# Altium schematic sheet jfino-anchor.SchDoc: jfino-anchor
size A3; ApprovedBy: batt; Author: djeasy; Revision: 1.0 2017; SheetNumber: 1; SheetTotal: 1
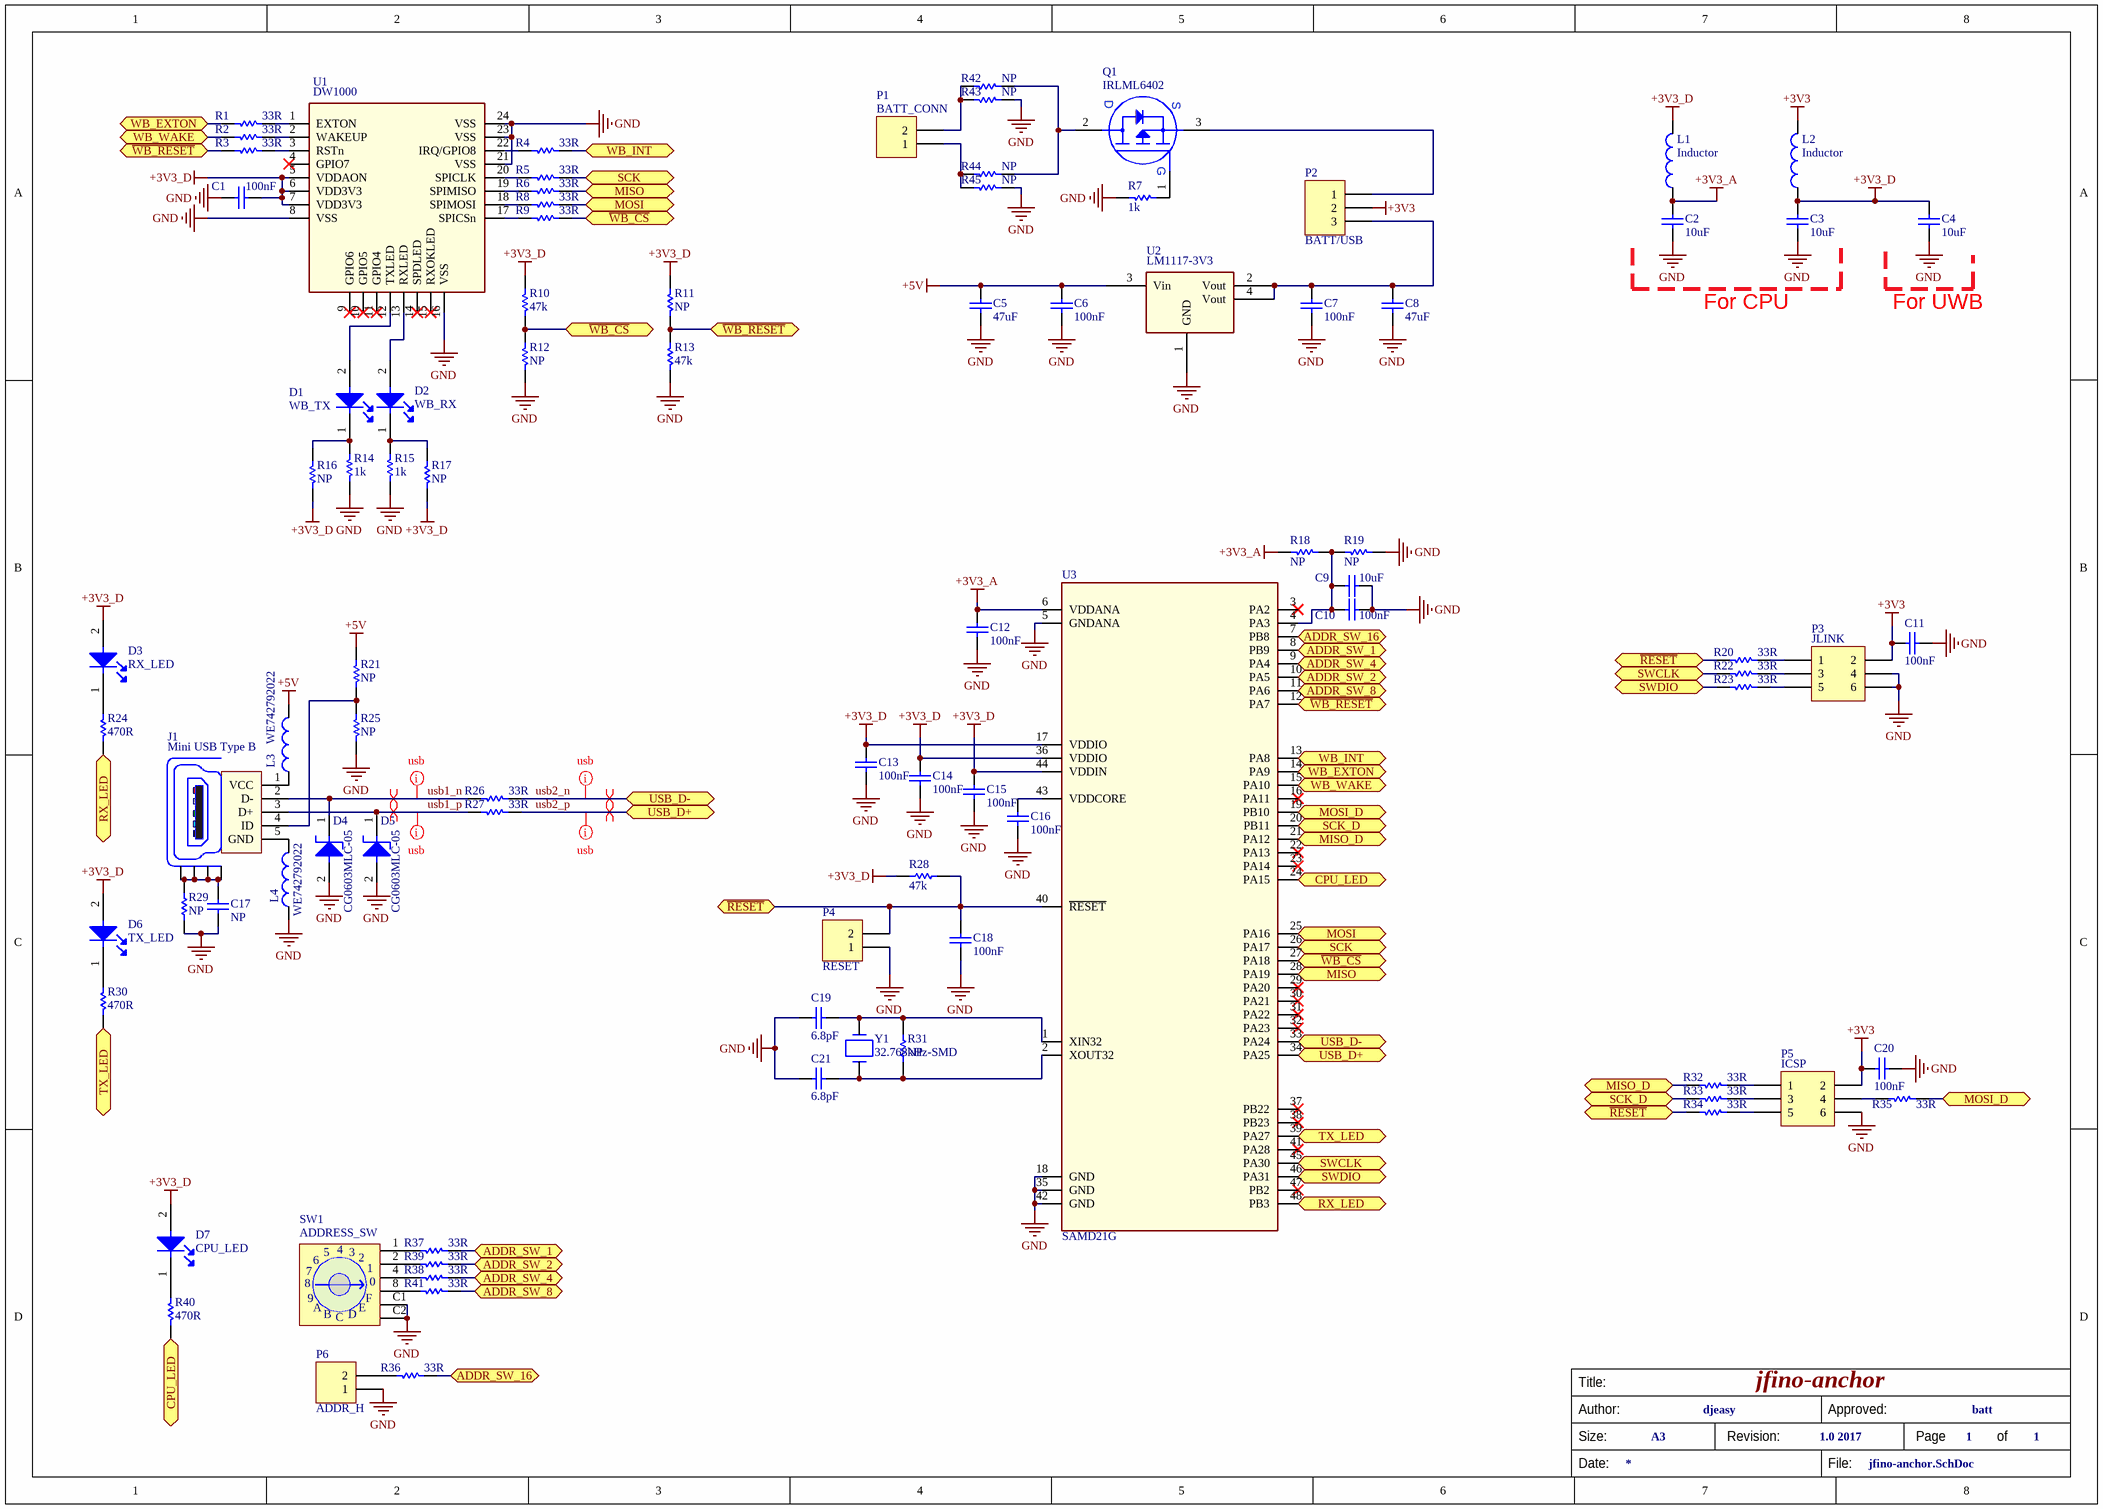
[diagram p0: jfino-anchor.SchDoc]

## Parts
C1  100nF  [0603_[1608]]
C2  10uF  [1206_[3216]]
C3  10uF  [1206_[3216]]
C4  10uF  [1206_[3216]]
C5  47uF  [1206_[3216]]
C6  100nF  [0603_[1608]]
C7  100nF  [0603_[1608]]
C8  47uF  [1206_[3216]]
C9  10uF  [1206_[3216]]
C10  100nF  [0603_[1608]]
C11  100nF  [0603_[1608]]
C12  100nF  [0603_[1608]]
C13  100nF  [0603_[1608]]
C14  100nF  [0603_[1608]]
C15  100nF  [0603_[1608]]
C16  100nF  [0603_[1608]]
C17  NP  [1808_[4520]]
C18  100nF  [0603_[1608]]
C19  6.8pF  [0603_[1608]]
C20  100nF  [0603_[1608]]
C21  6.8pF  [0603_[1608]]
D1  WB_TX  [0603_[1608]_K1-A2_LED]
D2  WB_RX  [0603_[1608]_K1-A2_LED]
D3  RX_LED  [0603_[1608]_K1-A2_LED]
D4  CG0603MLC-05  [0603_[1608]]
D5  CG0603MLC-05  [0603_[1608]]
D6  TX_LED  [0603_[1608]_K1-A2_LED]
D7  CPU_LED  [0603_[1608]_K1-A2_LED]
J1  Mini USB Type B  [USB_MICRO_B_SMD]
L1  Inductor  [0805_[2012]]
L2  Inductor  [0805_[2012]]
L3  WE742792022  [0805_[2012]]
L4  WE742792022  [0805_[2012]]
P1  BATT_CONN  [BATTERY_CONNECTOR_LIPO_THD]
P2  BATT/USB  [HEADER_1X3_2.54MM_THD]
P3  JLINK  [HEADER_2X3_2.54MM_THD]
P4  RESET  [HEADER_1X2_2.54MM_THD]
P5  ICSP  [HEADER_2X3_2.54MM_THD]
P6  ADDR_H  [HEADER_1X2_2.54MM_THD]
Q1  IRLML6402  [SOT-23]
R1  33R  [0603_[1608]]
R2  33R  [0603_[1608]]
R3  33R  [0603_[1608]]
R4  33R  [0603_[1608]]
R5  33R  [0603_[1608]]
R6  33R  [0603_[1608]]
R7  1k  [0603_[1608]]
R8  33R  [0603_[1608]]
R9  33R  [0603_[1608]]
R10  47k  [0603_[1608]]
R11  NP  [0603_[1608]]
R12  NP  [0603_[1608]]
R13  47k  [0603_[1608]]
R14  1k  [0603_[1608]]
R15  1k  [0603_[1608]]
R16  NP  [0603_[1608]]
R17  NP  [0603_[1608]]
R18  NP  [0603_[1608]]
R19  NP  [0603_[1608]]
R20  33R  [0603_[1608]]
R21  NP  [0603_[1608]]
R22  33R  [0603_[1608]]
R23  33R  [0603_[1608]]
R24  470R  [0603_[1608]]
R25  NP  [0603_[1608]]
R26  33R  [0603_[1608]]
R27  33R  [0603_[1608]]
R28  47k  [0603_[1608]]
R29  NP  [0805_[2012]]
R30  470R  [0603_[1608]]
R31  NP  [0603_[1608]]
R32  33R  [0603_[1608]]
R33  33R  [0603_[1608]]
R34  33R  [0603_[1608]]
R35  33R  [0603_[1608]]
R36  33R  [0603_[1608]]
R37  33R  [0603_[1608]]
R38  33R  [0603_[1608]]
R39  33R  [0603_[1608]]
R40  470R  [0603_[1608]]
R41  33R  [0603_[1608]]
R42  NP  [0603_[1608]]
R43  NP  [0603_[1608]]
R44  NP  [0603_[1608]]
R45  NP  [0603_[1608]]
SW1  ADDRESS_SW  [rotary_switch]
U1  DW1000  [DWM1000]
U2  LM1117-3V3  [SOT-223]
U3  SAMD21G  [LQFP-48_7x7MM_0.5MM]
Y1  32.768kHz-SMD  [CRYSTAL_4X1.5MM_2P_SMD]

## Ports
ADDR_SW_1 (bidir), ADDR_SW_2 (bidir), ADDR_SW_4 (bidir), ADDR_SW_8 (bidir), ADDR_SW_16 (bidir), CPU_LED (bidir), MISO (bidir), MISO_D (bidir), MOSI (bidir), MOSI_D (bidir), RX_LED (bidir), SCK (bidir), SCK_D (bidir), SWCLK (bidir), SWDIO (bidir), TX_LED (bidir), USB_D+ (bidir), USB_D- (bidir), WB_EXTON (bidir), WB_INT (bidir), WB_WAKE (bidir), ~{RESET} (bidir), ~{WB_CS} (bidir), ~{WB_RESET} (bidir)

## Nets
+3V3: C11.1 C20.1 L2.2 P2.2 P3.2 P5.2
+3V3_A: C2.2 C12.2 L1.1 R18.2 U3.6(VDDANA)
+3V3_D: C1.2 C3.2 C4.2 C13.2 C14.2 C15.2 D3.2(A) D6.2(A) D7.2(A) L1.2 L2.1 R10.2 R11.2 R16.1 R17.1 R28.2 U1.5(VDDAON) U1.6(VDD3V3) U1.7(VDD3V3) U3.17(VDDIO) U3.36(VDDIO) U3.44(VDDIN)
+5V: C5.2 C6.2 L3.2 R21.2 U2.3(Vin)
GND: C1.1 C2.1 C3.1 C4.1 C5.1 C6.1 C7.1 C8.1 C9.1 C10.1 C11.2 C12.1 C13.1 C14.1 C15.1 C16.1 C17.1 C18.1 C19.2 C20.2 C21.2 D4.2 D5.2 L4.1 P3.4 P3.6 P4.1 P5.6 P6.1 R7.2 R12.2 R13.2 R14.1 R15.1 R19.1 R25.1 R29.2 R43.2 R45.2 SW1.C1 SW1.C2 U1.8(VSS) U1.16(VSS) U1.21(VSS) U1.23(VSS) U1.24(VSS) U2.1(GND) U3.5(GNDANA) U3.18(GND) U3.35(GND) U3.42(GND)
~{RESET}: C18.2 P4.2 R20.1 R28.1 R34.1 U3.40(~{RESET}) ; port ~{RESET}
~{WB_CS}: R9.2 R10.1 R12.1 U3.27(PA18) ; port ~{WB_CS}
~{WB_RESET}: R3.1 R11.1 R13.1 U3.12(PA7) ; port ~{WB_RESET}
ADDR_SW_1: R37.2 U3.8(PB9) ; port ADDR_SW_1
ADDR_SW_2: R39.2 U3.10(PA5) ; port ADDR_SW_2
ADDR_SW_4: R38.2 U3.9(PA4) ; port ADDR_SW_4
ADDR_SW_8: R41.2 U3.11(PA6) ; port ADDR_SW_8
ADDR_SW_16: R36.2 U3.7(PB8) ; port ADDR_SW_16
CPU_LED: R40.1 U3.24(PA15) ; port CPU_LED
MISO: R6.2 U3.28(PA19) ; port MISO
MISO_D: R32.1 U3.21(PA12) ; port MISO_D
MOSI: R8.2 U3.25(PA16) ; port MOSI
MOSI_D: R35.2 U3.19(PB10) ; port MOSI_D
RX_LED: R24.1 U3.48(PB3) ; port RX_LED
SCK: R5.2 U3.26(PA17) ; port SCK
SCK_D: R33.1 U3.20(PB11) ; port SCK_D
SWCLK: R22.1 U3.45(PA30) ; port SWCLK
SWDIO: R23.1 U3.46(PA31) ; port SWDIO
TX_LED: R30.1 U3.39(PA27) ; port TX_LED
usb1_n: D4.1 J1.2(D-) R26.1
usb1_p: D5.1 J1.3(D+) R27.1
usb2_n: R26.2 U3.33(PA24) ; port USB_D-
usb2_p: R27.2 U3.34(PA25) ; port USB_D+
WB_EXTON: R1.1 U3.14(PA9) ; port WB_EXTON
WB_INT: R4.2 U3.13(PA8) ; port WB_INT
WB_WAKE: R2.1 U3.15(PA10) ; port WB_WAKE
NetC7_2: C7.2 C8.2 P2.3 U2.2(Vout) U2.4(Vout)
NetC9_2: C9.2 C10.2 R18.1 R19.2 U3.4(PA3)
NetC16_2: C16.2 U3.43(VDDCORE)
NetC17_2: C17.2 J1.Z1(Shield) J1.Z2(Shield) J1.Z3(Shield) J1.Z4(Shield) R29.1
NetC19_1: C19.1 R31.1 U3.1(XIN32) Y1.2
NetC21_1: C21.1 R31.2 U3.2(XOUT32) Y1.1
NetD1_1: D1.1(K) R14.2 R16.2
NetD1_2: D1.2(A) U1.12(TXLED)
NetD2_1: D2.1(K) R15.2 R17.2
NetD2_2: D2.2(A) U1.13(RXLED)
NetD3_1: D3.1(K) R24.2
NetD6_1: D6.1(K) R30.2
NetD7_1: D7.1(K) R40.2
NetJ1_1: J1.1(VCC) L3.1
NetJ1_4: J1.4(ID) R21.1 R25.2
NetJ1_5: J1.5(GND) L4.2
NetP1_1: P1.1 R44.1 R45.1
NetP1_2: P1.2 R42.1 R43.1
NetP2_1: P2.1 Q1.3(S)
NetP3_1: P3.1 R20.2
NetP3_3: P3.3 R22.2
NetP3_5: P3.5 R23.2
NetP5_1: P5.1 R32.2
NetP5_3: P5.3 R33.2
NetP5_4: P5.4 R35.1
NetP5_5: P5.5 R34.2
NetP6_2: P6.2 R36.1
NetQ1_1: Q1.1(G) R7.1
NetQ1_2: Q1.2(D) R42.2 R44.2
NetR1_2: R1.2 U1.1(EXTON)
NetR2_2: R2.2 U1.2(WAKEUP)
NetR3_2: R3.2 U1.3(RSTn)
NetR4_1: R4.1 U1.22(IRQ/GPIO8)
NetR5_1: R5.1 U1.20(SPICLK)
NetR6_1: R6.1 U1.19(SPIMISO)
NetR8_1: R8.1 U1.18(SPIMOSI)
NetR9_1: R9.1 U1.17(SPICSn)
NetR37_1: R37.1 SW1.1
NetR38_1: R38.1 SW1.4
NetR39_1: R39.1 SW1.2
NetR41_1: R41.1 SW1.8

Not connected (* = marked no-connect by the designer): U1 4(GPIO7)* 9(GPIO6)* 10(GPIO5)* 11(GPIO4)* 14(SPDLED)* 15(RXOKLED)*; U3 3(PA2)* 16(PA11)* 22(PA13)* 23(PA14)* 29(PA20)* 30(PA21)* 31(PA22)* 32(PA23)* 37(PB22)* 38(PB23)* 41(PA28)* 47(PB2)*

## Layout directives
net class USB: usb1_n, usb1_p, usb2_n, usb2_p
differential pair: usb1_n, usb1_p, usb2_n, usb2_p

## Notes on the sheet
- For CPU
- For UWB
- Title:
- Author:
- Size:
- Date:
- A3
- Revision:
- File:
- Approved:
- Page
- of
- (in symbol Rotary Switch HEX) 5; 3; 6; 7; 0; 9; F; A; E; B; D; C

## Library data of the parts
C1-C21 = Cap: Capacitor; Value: 10nF; Published: 8-Jun-2000; Revision: July-2002: Re-released for DXP Platform.; Publisher: Altium Limited
D1-D3 D6 D7 = LED: Multicolor LED
D4 D5 = TVS
J1 = USB_Con_Type_B_mini_SMT: Mini USB SMT Type B 5 Contacts; Manufacturer: Würth Elektronik eiSos GmbH; partNo: 65100516121; ComponentLink1 Description: Manufacturer; ComponentLink2 Description: Datasheet; NoPins: 5; ComponentLink1URL: http://www.we-online.de; ComponentLink2URL: http://katalog.we-online.de/em/datasheet/65100516121.pdf; Created by: Karrer Zheng; Created Date: 10/10/2014
L1-L4 = Inductor: Ferrite (WE 742792022)
P1 P4 P6 = Header 2: Header, 2-Pin; LatestRevisionDate: 17-Jul-2002; LatestRevisionNote: Re-released for DXP Platform.; Publisher: Altium Limited
P2 = Header 3: Header, 3-Pin; LatestRevisionDate: 17-Jul-2002; LatestRevisionNote: Re-released for DXP Platform.; Publisher: Altium Limited
P3 P5 = Header 3X2: Header, 3-Pin, Dual row; LatestRevisionDate: 17-Jul-2002; LatestRevisionNote: Re-released for DXP Platform.; Publisher: Altium Limited
Q1 = MOSFET-P 3pin: MOSFET P
R1-R6 R8-R13 R16-R45 = Res1: Resistor; Value: 1K; Published: 8-Jun-2000; Revision: July-2002: Re-released for DXP Platform.; Publisher: Altium Limited
R7 R14 R15 = Res1: Resistor; Published: 8-Jun-2000; Revision: July-2002: Re-released for DXP Platform.; Publisher: Altium Limited; Value: 1K
SW1 = Rotary Switch HEX: SMD Rotary HEX Switch 10x10mm 2.54mm; PartNumber: 428521320810; NoPins: 06; PackageReference: 428521320810; ComponentLink1Description: Manufacturer URL; ComponentLink1URL: http://www.we-online.com; ComponentLink2Description: Datasheet; ComponentLink2URL: http://katalog.we-online.de/em/datasheet/428521320810.pdf
U2 = LM1117-FIXED-OUT: LM1117 LDO Fixed output
Y1 = 32.768kHz-SMD: Crystal 32.768kHz SMD 2-Pin; Part Number: Aker C2E-24.000-12-3030-X; Purchase Code: RS 671-9564